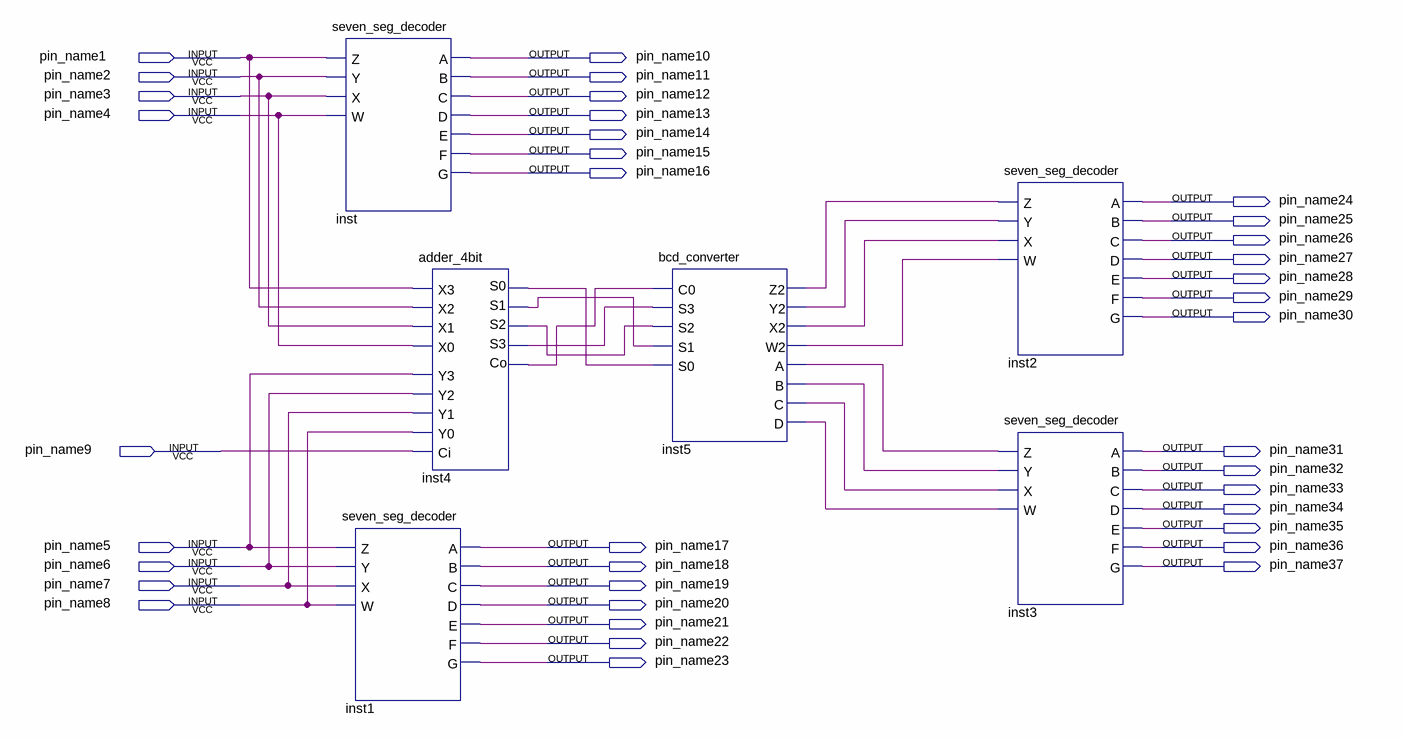
[diagram p0: schematic sheet]
// Quartus schematic lab06.bdf as structural Verilog: 6 symbols, 37 pins
module lab06 (
  input  pin_name1,
  input  pin_name2,
  input  pin_name3,
  input  pin_name4,
  input  pin_name9,
  input  pin_name5,
  input  pin_name6,
  input  pin_name7,
  input  pin_name8,
  output pin_name10,
  output pin_name11,
  output pin_name12,
  output pin_name13,
  output pin_name14,
  output pin_name15,
  output pin_name16,
  output pin_name24,
  output pin_name25,
  output pin_name26,
  output pin_name27,
  output pin_name28,
  output pin_name29,
  output pin_name30,
  output pin_name31,
  output pin_name32,
  output pin_name33,
  output pin_name34,
  output pin_name35,
  output pin_name17,
  output pin_name36,
  output pin_name18,
  output pin_name37,
  output pin_name19,
  output pin_name20,
  output pin_name21,
  output pin_name22,
  output pin_name23
);

  wire inst4_co, inst4_s0, inst4_s1, inst4_s2, inst4_s3, inst5_a, inst5_b, inst5_c, inst5_d, inst5_w2,
       inst5_x2, inst5_y2, inst5_z2;

  seven_seg_decoder inst (
    .Z(pin_name1), .Y(pin_name2), .X(pin_name3), .W(pin_name4), .A(pin_name10), .B(pin_name11),
    .C(pin_name12), .D(pin_name13), .E(pin_name14), .F(pin_name15), .G(pin_name16));
  seven_seg_decoder inst1 (
    .Z(pin_name5), .Y(pin_name6), .X(pin_name7), .W(pin_name8), .A(pin_name17), .B(pin_name18),
    .C(pin_name19), .D(pin_name20), .E(pin_name21), .F(pin_name22), .G(pin_name23));
  adder_4bit inst4 (
    .X3(pin_name1), .Y3(pin_name5), .X2(pin_name2), .Y2(pin_name6), .X1(pin_name3), .Y1(pin_name7),
    .X0(pin_name4), .Y0(pin_name8), .Ci(pin_name9), .S0(inst4_s0), .S1(inst4_s1), .S2(inst4_s2),
    .S3(inst4_s3), .Co(inst4_co));
  bcd_converter inst5 (
    .C0(inst4_co), .S3(inst4_s3), .S2(inst4_s2), .S1(inst4_s1), .S0(inst4_s0), .Z2(inst5_z2), .Y2(inst5_y2),
    .X2(inst5_x2), .W2(inst5_w2), .A(inst5_a), .B(inst5_b), .C(inst5_c), .D(inst5_d));
  seven_seg_decoder inst2 (
    .Z(inst5_z2), .Y(inst5_y2), .X(inst5_x2), .W(inst5_w2), .A(pin_name24), .B(pin_name25), .C(pin_name26),
    .D(pin_name27), .E(pin_name28), .F(pin_name29), .G(pin_name30));
  seven_seg_decoder inst3 (
    .Z(inst5_a), .Y(inst5_b), .X(inst5_c), .W(inst5_d), .A(pin_name31), .B(pin_name32), .C(pin_name33),
    .D(pin_name34), .E(pin_name35), .F(pin_name36), .G(pin_name37));
endmodule
